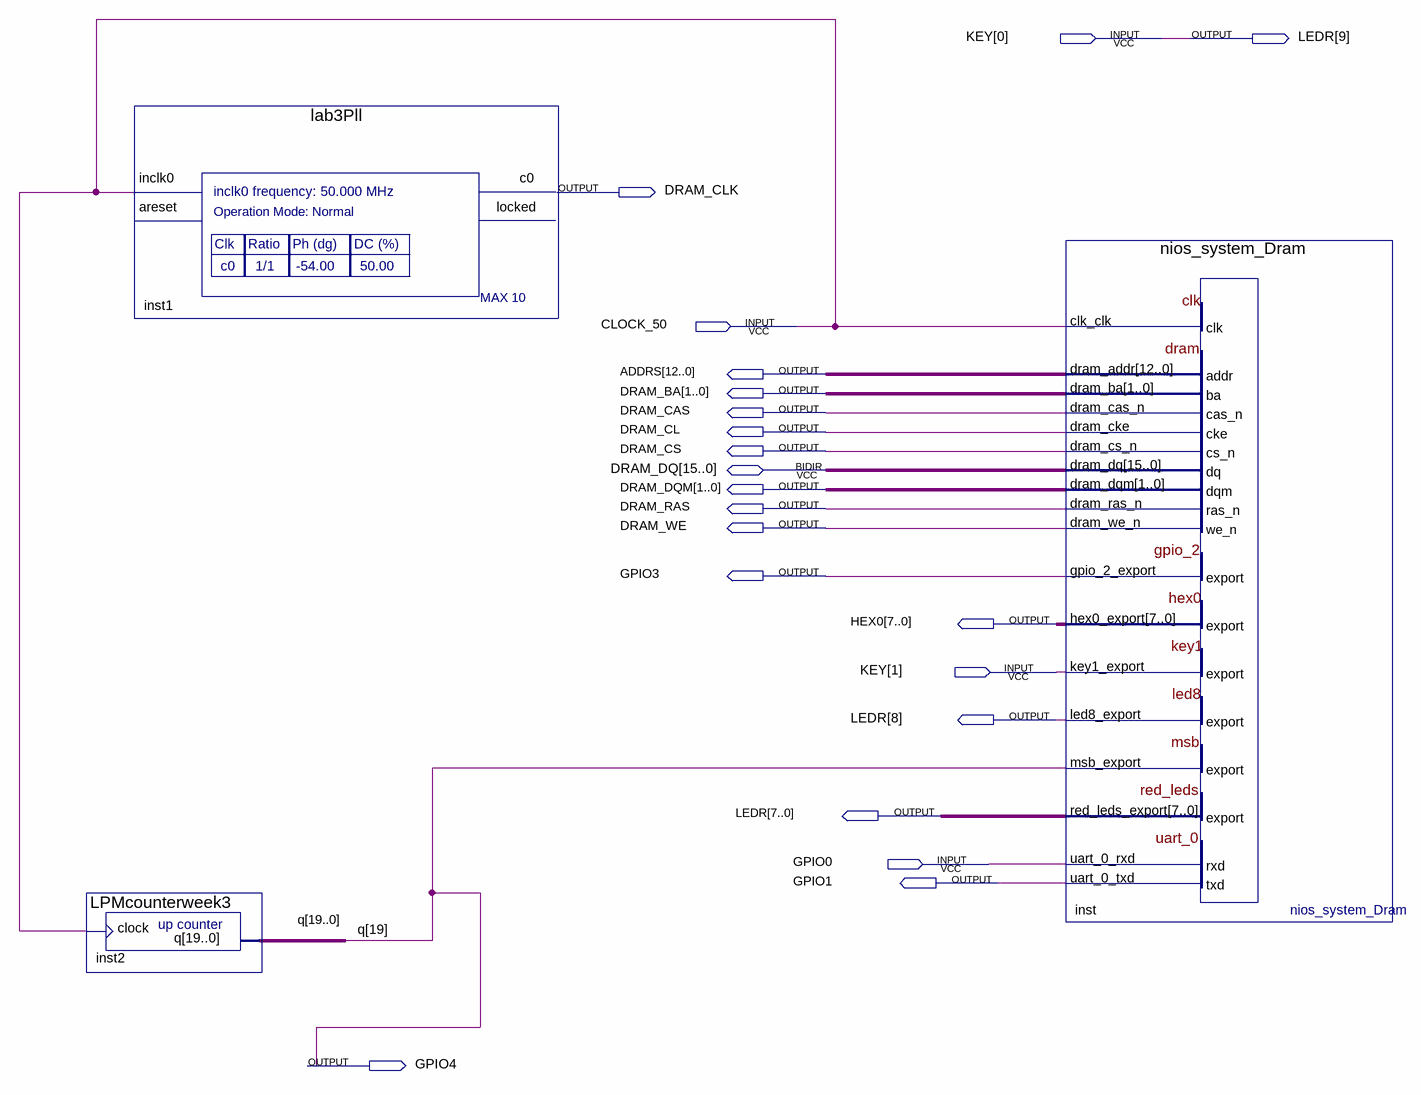
[diagram p0: schematic sheet]
// Quartus schematic ECE3073_Lab3.bdf as structural Verilog: 3 symbols, 21 pins
module ECE3073_Lab3 (
  input  [1:0] KEY,
  input  CLOCK_50,
  input  GPIO0,
  inout  [15:0] DRAM_DQ,
  output [9:0] LEDR,
  output DRAM_CLK,
  output [12:0] ADDRS,
  output [1:0] DRAM_BA,
  output DRAM_CAS,
  output DRAM_CL,
  output DRAM_CS,
  output [1:0] DRAM_DQM,
  output DRAM_RAS,
  output DRAM_WE,
  output GPIO3,
  output [7:0] HEX0,
  output GPIO1,
  output GPIO4
);

  wire [18:0] q;

  LPMcounterweek3 inst2 (.clock(CLOCK_50), .q({GPIO4, q}));
  lab3Pll inst1 (.inclk0(CLOCK_50), .c0(DRAM_CLK));  // open: areset, locked
  nios_system_Dram inst (
    .clk_clk(CLOCK_50), .key1_export(KEY[1]), .msb_export(GPIO4), .uart_0_rxd(GPIO0), .dram_addr(ADDRS),
    .dram_ba(DRAM_BA), .dram_cas_n(DRAM_CAS), .dram_cke(DRAM_CL), .dram_cs_n(DRAM_CS), .dram_dqm(DRAM_DQM),
    .dram_ras_n(DRAM_RAS), .dram_we_n(DRAM_WE), .gpio_2_export(GPIO3), .hex0_export(HEX0),
    .led8_export(LEDR[8]), .red_leds_export(LEDR[7:0]), .uart_0_txd(GPIO1), .dram_dq(DRAM_DQ));

  assign LEDR[9] = KEY[0];

  // Other names for the same wires on the sheet: q[19] = GPIO4
endmodule
